# Altium project EL2086.PrjPcb (part 3 of 3)

## Sheet LEFT_CCM.SchDoc: =project_title
size Tabloid; PageSetup: Record=PageOptions|CenterHorizontal=True|CenterVertical=True|PrintScale=0.71|XCorrection=1.00|YCorrection=1.00|PrintKind=0|BorderSize=5000000|LeftOffset=0|BottomOffset=0|Orientation=2|PaperLength=1000|PaperWidth=1000|Scale=100|PaperSource=7|PrintQuality=-4|MediaType=1|DitherType=10|PrintScaleMode=1|PaperKind=A4; CompanyName: Luxonis Holding; DrawnBy: Eason Lin; Organization: Luxonis Holding; Address1: 1925 Harmony Park Drive; Address2: Westminster, CO; Address3: 80234; Address4: United States; DocumentNumber: D2088000; Revision: R0M0E0; SheetNumber: 10; SheetTotal: 14
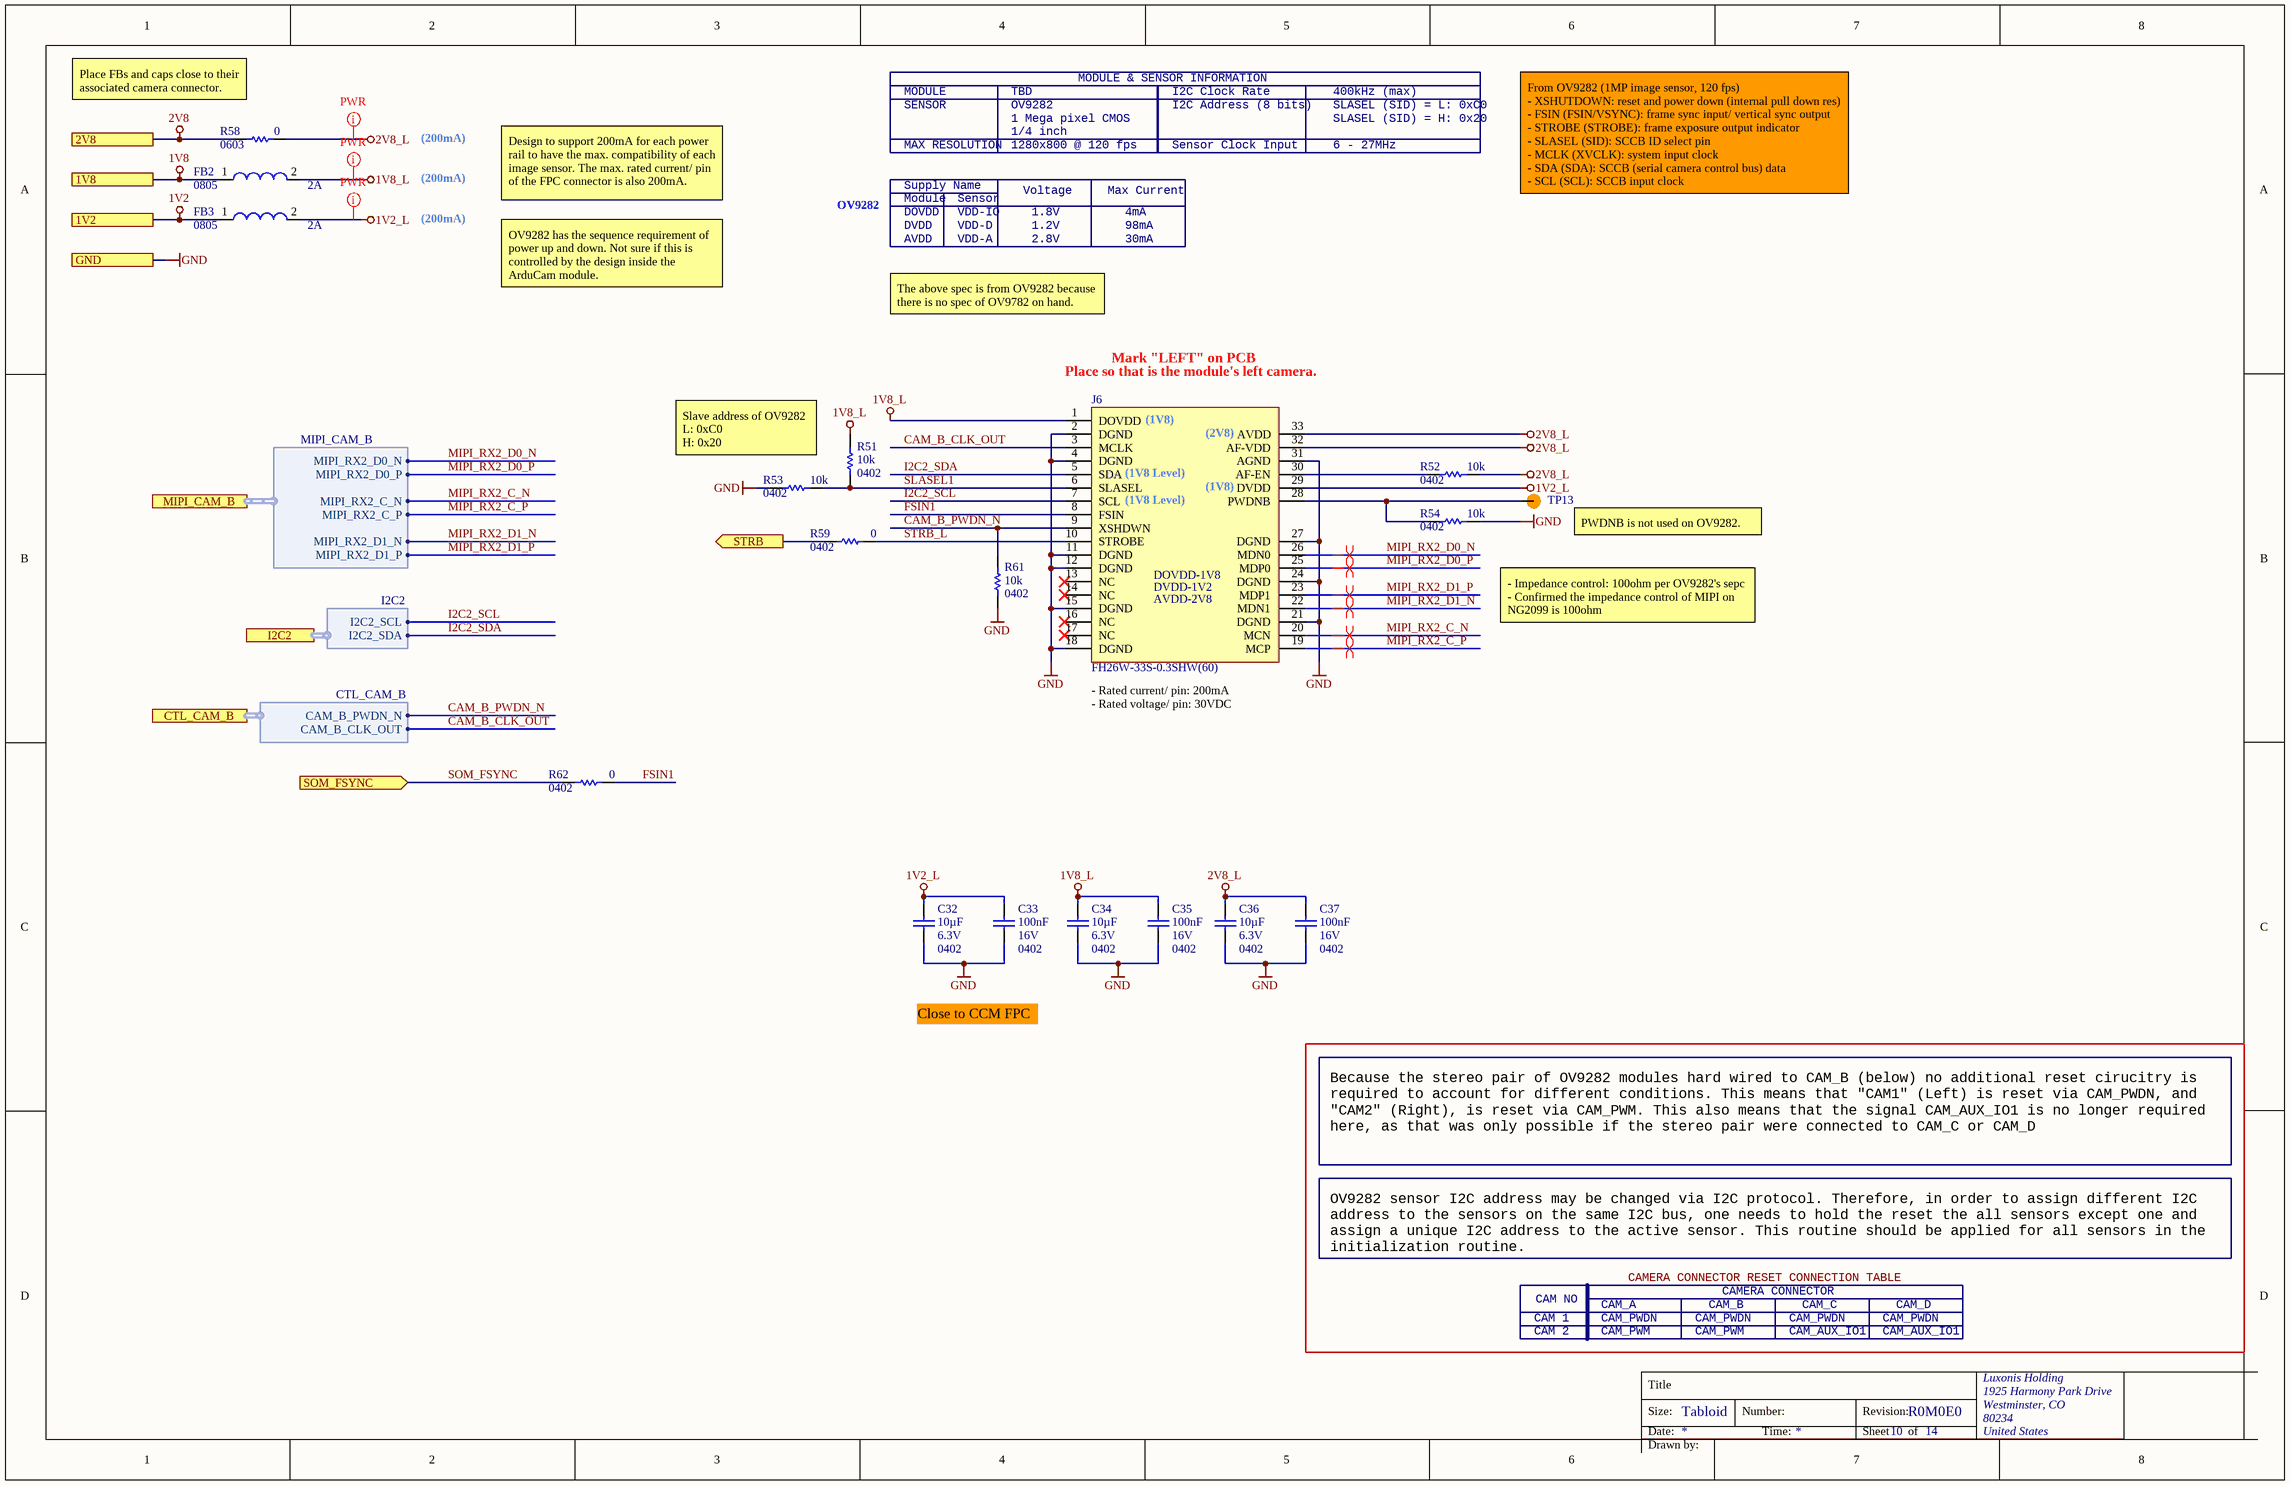
[diagram p9: LEFT_CCM.SchDoc]

### Parts
C32  value 10µF  Voltage Rating: 6.3V  Case/Package: 0402  [CAPC0402(1005)70_N]  (hidden comment: GRM155R60J106ME15D)
C33  value 100nF  Voltage Rating: 16V  Case/Package: 0402  [CAPC0402(1005)60_N]  (hidden comment: CL05B104KO5NFNC)
C34  value 10µF  Voltage Rating: 6.3V  Case/Package: 0402  [CAPC0402(1005)70_N]  (hidden comment: GRM155R60J106ME15D)
C35  value 100nF  Voltage Rating: 16V  Case/Package: 0402  [CAPC0402(1005)60_N]  (hidden comment: CL05B104KO5NFNC)
C36  value 10µF  Voltage Rating: 6.3V  Case/Package: 0402  [CAPC0402(1005)70_N]  (hidden comment: GRM155R60J106ME15D)
C37  value 100nF  Voltage Rating: 16V  Case/Package: 0402  [CAPC0402(1005)60_N]  (hidden comment: CL05B104KO5NFNC)
FB2  Current Rating: 2A  Case/Package: 0805  [2508056017Y2]  (hidden comment: 2508056017Y2)
FB3  Current Rating: 2A  Case/Package: 0805  [2508056017Y2]  (hidden comment: 2508056017Y2)
J6  FH26W-33S-0.3SHW(60)  [AC-PY003-OV9282]
R51  value 10k  Case/Package: 0402  [RESC0402(1005)_N]  (hidden comment: RC0402FR-1310KL)
R52  value 10k  Case/Package: 0402  [RESC0402(1005)_N]  (hidden comment: RC0402FR-1310KL)
R53  value 10k  Case/Package: 0402  [RESC0402(1005)_N]  (hidden comment: RC0402FR-1310KL)
R54  value 10k  Case/Package: 0402  [RESC0402(1005)_N]  (hidden comment: RC0402FR-1310KL)
R58  value 0  Case/Package: 0603  [RESC0603(1608)_N]  (hidden comment: CRCW06030000Z0EA)
R59  value 0  Case/Package: 0402  [RESC0402(1005)_L]  (hidden comment: CRCW04020000Z0ED)
R61  value 10k  Case/Package: 0402  [RESC0402(1005)_N]  (hidden comment: RC0402FR-1310KL)
R62  value 0  Case/Package: 0402  [RESC0402(1005)_L]  (hidden comment: CRCW04020000Z0ED)
TP13  TP075_150_NS  [TP075_150_NS]  (value not drawn)  (no BOM)

### Ports
1V2, 1V8, 2V8, CTL_CAM_B (harness CTL_CAM_B), GND, I2C2 (harness I2C2), MIPI_CAM_B (harness MIPI_CAM_B), SOM_FSYNC (in), STRB (out)

### Harnesses
MIPI_CAM_B: MIPI_RX2_D1_P, MIPI_RX2_D1_N, MIPI_RX2_D0_N, MIPI_RX2_D0_P, MIPI_RX2_C_N, MIPI_RX2_C_P
I2C2: I2C2_SDA, I2C2_SCL
CTL_CAM_B: CAM_B_PWDN_N, CAM_B_CLK_OUT

### Nets
1V2: FB3.1 ; port 1V2
1V2_L: C32.2 C33.2 FB3.2 J6.29(DVDD)
1V8: FB2.1 ; port 1V8
1V8_L: C34.2 C35.2 FB2.2 J6.1(DOVDD) R51.2
2V8: R58.1 ; port 2V8
2V8_L: C36.2 C37.2 J6.32(AF-VDD) J6.33(AVDD) R52.2 R58.2
GND: C32.1 C33.1 C34.1 C35.1 C36.1 C37.1 J6.2(DGND) J6.4(DGND) J6.11(DGND) J6.12(DGND) J6.15(DGND) J6.18(DGND) J6.21(DGND) J6.24(DGND) J6.27(DGND) J6.31(AGND) R53.1 R54.2 R61.1 ; port GND
CAM_B_CLK_OUT: J6.3(MCLK) ; port CTL_CAM_B.CAM_B_CLK_OUT
CAM_B_PWDN_N: J6.9(XSHDWN) R61.2 ; port CTL_CAM_B.CAM_B_PWDN_N
FSIN1: J6.8(FSIN) R62.1
I2C2_SCL: J6.7(SCL) ; port I2C2.I2C2_SCL
I2C2_SDA: J6.5(SDA) ; port I2C2.I2C2_SDA
MIPI_RX2_C_N: J6.20(MCN) ; port MIPI_CAM_B.MIPI_RX2_C_N
MIPI_RX2_C_P: J6.19(MCP) ; port MIPI_CAM_B.MIPI_RX2_C_P
MIPI_RX2_D0_N: J6.26(MDN0) ; port MIPI_CAM_B.MIPI_RX2_D0_N
MIPI_RX2_D0_P: J6.25(MDP0) ; port MIPI_CAM_B.MIPI_RX2_D0_P
MIPI_RX2_D1_N: J6.22(MDN1) ; port MIPI_CAM_B.MIPI_RX2_D1_N
MIPI_RX2_D1_P: J6.23(MDP1) ; port MIPI_CAM_B.MIPI_RX2_D1_P
SLASEL1: J6.6(SLASEL) R51.1 R53.2
SOM_FSYNC: R62.2 ; port SOM_FSYNC
STRB: R59.2 ; port STRB
STRB_L: J6.10(STROBE) R59.1
NetJ6_28: J6.28(PWDNB) R54.1 TP13.1
NetJ6_30: J6.30(AF-EN) R52.1

Not connected (* = marked no-connect by the designer): J6 13(NC)* 14(NC)* 16(NC)* 17(NC)*

### Layout directives
differential pair; net class MIPI; differential pair class 100ohm: MIPI_RX2_C_N, MIPI_RX2_C_P, MIPI_RX2_D0_N, MIPI_RX2_D0_P, MIPI_RX2_D1_N, MIPI_RX2_D1_P
net class PWR; Current Rating: 200mA: 1V2_L, 1V8_L, 2V8_L

### Notes on the sheet
- (near R58) Place FBs and caps close to their associated camera connector.
- MODULE
- TBD
- MODULE & SENSOR INFORMATION
- I2C Clock Rate
- 400kHz (max)
- (200mA)
- SENSOR
- MAX RESOLUTION
- 1 Mega pixel CMOS
- 1280x800 @ 120 fps
- OV9282
- 1/4 inch
- I2C Address (8 bits)
- Sensor Clock Input
- SLASEL (SID) = L: 0xC0
- SLASEL (SID) = H: 0x20
- 6 - 27MHz
- Design to support 200mA for each power rail to have the max. compatibility of each image sensor. The max. rated current/ pin of the FPC connector is also 200mA.
- DOVDD
- DVDD
- Supply Name
- Module
- VDD-IO
- VDD-D
- Sensor
- Voltage
- 1.8V
- 1.2V
- Max Current
- 4mA
- 98mA
- From OV9282 (1MP image sensor, 120 fps)
  - XSHUTDOWN: reset and power down (internal pull down res)
  - FSIN (FSIN/VSYNC): frame sync input/ vertical sync output
  - STROBE (STROBE): frame exposure output indicator
  - SLASEL (SID): SCCB ID select pin
  - MCLK (XVCLK): system input clock
  - SDA (SDA): SCCB (serial camera control bus) data
  - SCL (SCL): SCCB input clock
- OV9282 has the sequence requirement of power up and down. Not sure if this is controlled by the design inside the ArduCam module.
- AVDD
- VDD-A
- 2.8V
- 30mA
- The above spec is from OV9282 because there is no spec of OV9782 on hand.
- Mark "LEFT" on PCB
- (near J6) Place so that is the module's left camera.
- (near J6) (1V8)
- (near J6) (2V8)
- Slave address of OV9282
  L: 0xC0
  H: 0x20
- (near J6) (1V8 Level)
- (near TP13) PWDNB is not used on OV9282.
- - Impedance control: 100ohm per OV9282's sepc
  - Confirmed the impedance control of MIPI on NG2099 is 100ohm
- (near J6) - Rated current/ pin: 200mA
  - Rated voltage/ pin: 30VDC
- Close to CCM FPC
- Because the stereo pair of OV9282 modules hard wired to CAM_B (below) no additional reset cirucitry is required to account for different conditions. This means that "CAM1" (Left) is reset via CAM_PWDN, and "CAM2" (Right), is reset via CAM_PWM. This also means that the signal CAM_AUX_IO1 is no longer required here, as that was only possible if the stereo pair were connected to CAM_C or CAM_D
- OV9282 sensor I2C address may be changed via I2C protocol. Therefore, in order to assign different I2C address to the sensors on the same I2C bus, one needs to hold the reset the all sensors except one and assign a unique I2C address to the active sensor. This routine should be applied for all sensors in the initialization routine.
- CAM NO
- CAMERA CONNECTOR RESET CONNECTION TABLE
- CAMERA CONNECTOR
- CAM 1
- CAM 2
- CAM_A
- CAM_PWDN
- CAM_PWM
- CAM_B
- CAM_AUX_IO1
- CAM_C
- CAM_D
- Title
- Size:
- Date:
- Tabloid
- Number:
- Time:
- Revision:
- Sheet
- of
- Drawn by:
- (in symbol AC_PY003-OV9282_CON) DOVDD-1V8; DVDD-1V2; AVDD-2V8

### Library data of the parts
C32 C34 C36 = CMP-004-000009-5: CAP CER 10UF 6.3V X5R 0402 20%; Manufacturer 1: Murata; Dielectric: X5R; Manufacturer Part Number 1: GRM155R60J106ME15D; ComponentLink1URL: https://www.murata.com/~/media/webrenewal/support/library/catalog/products/capacitor/mlcc/c02e.ashx?la=en-us&src-supplier=Digi-Key; Design Item ID: GRM155R60J106ME15D; Tolerance: 20%; Width: 0.02inch; Length: 0.039inch; Mounting Technology: SMT; Min Operating Temperature: -55°C; Max Operating Temperature: 85°C; ComponentLink1Description: https://www.murata.com/~/media/webrenewal/support/library/catalog/products/capacitor/mlcc/c02e.ashx?la=en-us&src-supplier=Digi-Key
C33 C35 C37 = CMP-108-000002-6: CAP CER 0.1UF 16V X7R 0402 10%; Manufacturer 1: Samsung; ComponentLink1URL: https://datasheet.ciiva.com/25767/cl05b104ko5nfnc-25767124.pdf?src-supplier=Digi-Key; Length: 1mm; Design Item ID: CL05B104KO5NFNC; Tolerance: 10%; Min Operating Temperature: -55°C; Width: 0.02inch; Dielectric: X7R; ComponentLink1Description: https://datasheet.ciiva.com/25767/cl05b104ko5nfnc-25767124.pdf?src-supplier=Digi-Key; Height: 0.5mm; Depth: 0.5mm; Manufacturer Part Number 1: CL05B104KO5NFNC; Max Operating Temperature: 125°C; Mounting Technology: SMT
FB2 FB3 = CMP-082-000000-2: FERRITE BEAD, 0.1OHM, 2A, 0805, 600R/100MHz; Manufacturer 1: Fair-Rite; Tolerance: 25%; Manufacturer Part Number 1: 2508056017Y2
J6 = AC_PY003-OV9282_CON: FFC/FPC Connector, 33 Contact(s), 1 Row(s), Female, Right Angle, Surface Mount Terminal; Manufacturer 1: Hirose; Supplier 1: Digi-Key; Manufacturer Part Number 1: FH26W-33S-0.3SHW(60); RoHS: Yes; Category: FFC / FPC; Stock 1: 627; Pricing 1: 1=1,78000, 10=1,61700, 25=1,51800, 50=1,45200, 100=1,38600, 250=1,25400, 500=1,15500, 1000=0,99000, 2500=0,92400 (USD); ComponentLink1URL: https://datasheet.ciiva.com:443/pdfs/VipMasterIC/IC/HIRO/HIRO-S-A0007913874/HIRO-S-A0008593114-1.pdf?src-supplier=IHS+Markit; ComponentLink1Description: https://datasheet.ciiva.com:443/pdfs/VipMasterIC/IC/HIRO/HIRO-S-A0007913874/HIRO-S-A0008593114-1.pdf?src-supplier=IHS+Markit; ComponentLink2URL: https://www.hirose.com/product/en/download_file/key_name/FH26/category/Catalog/doc_file_id/49355/?file_category_id=4&item_id=298&is_series=1&src-supplier=Digi-Key; ComponentLink2Description: https://www.hirose.com/product/en/download_file/key_name/FH26/category/Catalog/doc_file_id/49355/?file_category_id=4&item_id=298&is_series=1&src-supplier=Digi-Key; ComponentLink3URL: https://www.hirose.com/product/download/?distributor=digikey&amp;type=2d&amp;lang=en&amp;num=FH26W-13S-0.3SHW(60)&src-supplier=Digi-Key; ComponentLink3Description: https://www.hirose.com/product/download/?distributor=digikey&amp;type=2d&amp;lang=en&amp;num=FH26W-13S-0.3SHW(60)&src-supplier=Digi-Key; Supplier Part Number 1: H125800CT-ND
R51-R54 R61 = CMP-115-000004-8: as R93-R95 on sheet TOF_VGA; Min Operating Temperature: -55°C; Max Operating Temperature: 155°C; Design Item ID: RC0402FR-1310KL; Tolerance: 1%; Manufacturer Part Number 1: RC0402FR-1310KL
R58 = CMP-115-000011-7: RES SMD 0 OHM 5% 1/10W 0603; Manufacturer 1: Vishay; Manufacturer Part Number 1: CRCW0603-0000Z0EA; Temperature Coefficient: 100ppm/°C; Power Rating: 100mW; Voltage Rating: 75V; Tolerance: 5%; Design Item ID: CRCW06030000Z0EA; Max Operating Temperature: 155°C; Min Operating Temperature: -55°C
R59 R62 = CMP-013-000022-11: RES SMD 0 OHM 5% 1/16W 0402; Manufacturer 1: Vishay; Voltage Rating: 50V; Power Rating: 63mW; Max Operating Temperature: 155°C; Manufacturer Part Number 1: CRCW04020000Z0ED; Tolerance: 5%; Min Operating Temperature: -55°C; Design Item ID: CRCW04020000Z0ED
TP13 = TEST_POINT

## Sheet IMU.SchDoc: =project_title
size Tabloid; CompanyName: Luxonis Holding; DrawnBy: Eason Lin; Organization: Luxonis Holding; Address1: 1925 Harmony Park Drive; Address2: Westminster, CO; Address3: 80234; Address4: United States; DocumentNumber: D2088000; Revision: R0M0E0; SheetNumber: 9; SheetTotal: 14
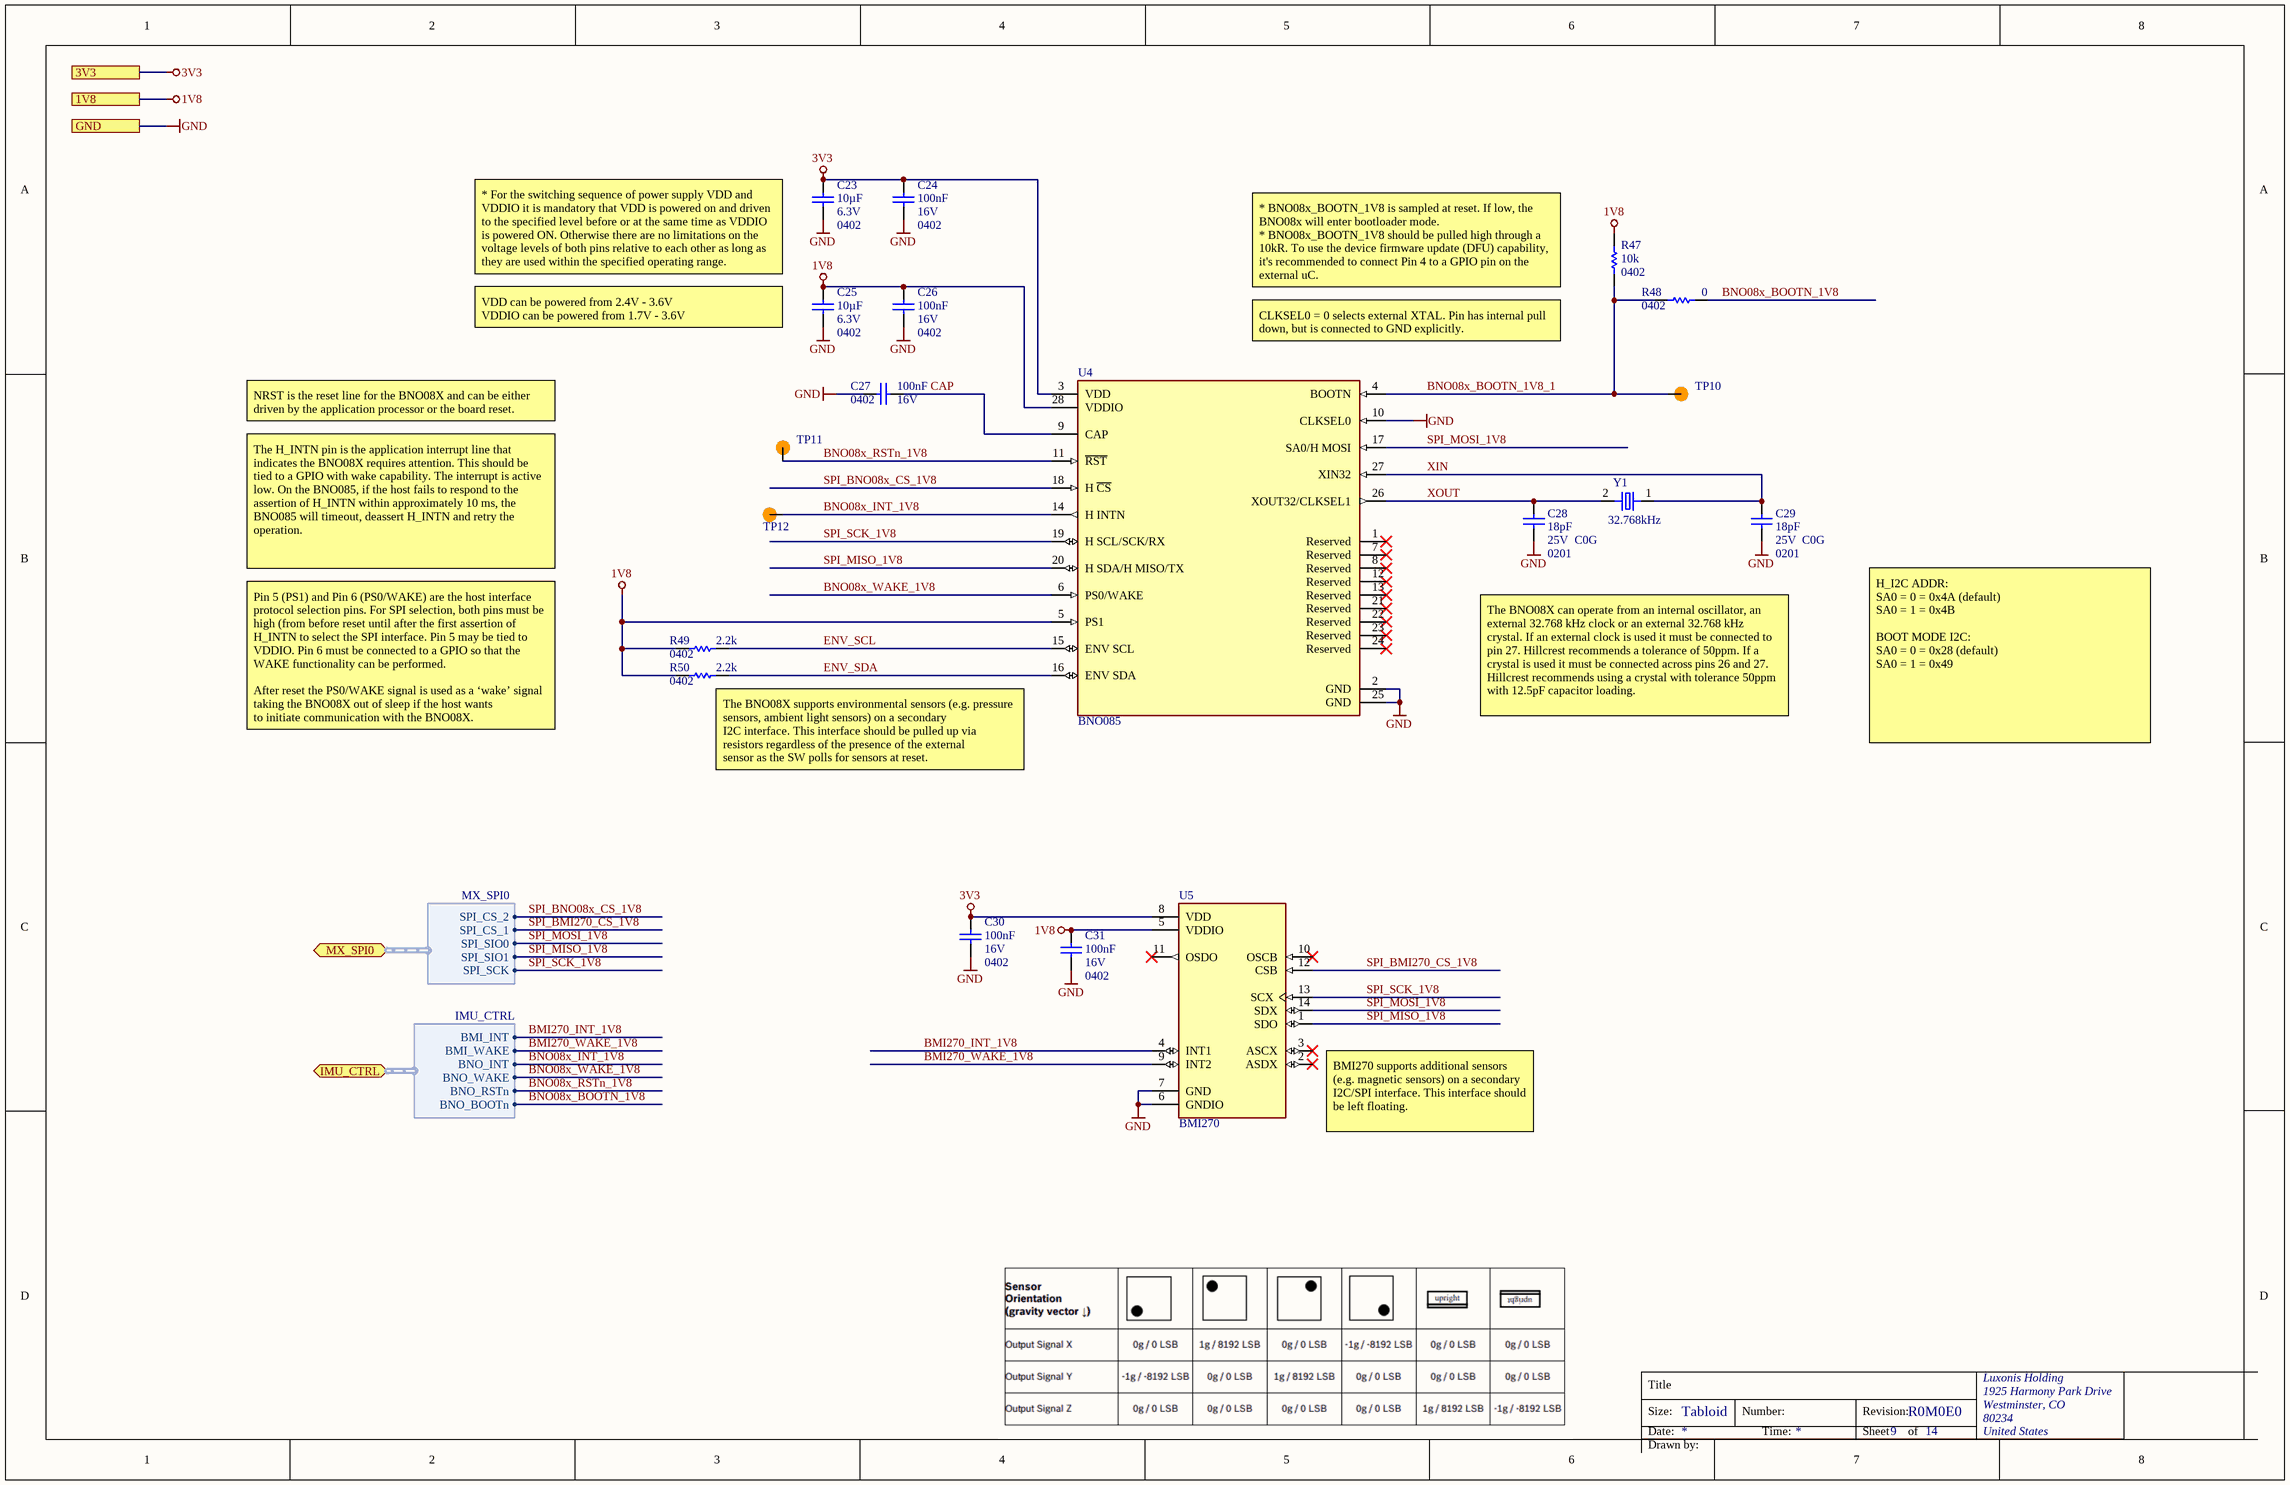
[diagram p10: IMU.SchDoc]

### Parts
C23  value 10µF  Voltage Rating: 6.3V  Case/Package: 0402  [CAPC0402(1005)70_N]  (hidden comment: GRM155R60J106ME15D)
C24  value 100nF  Voltage Rating: 16V  Case/Package: 0402  [CAPC0402(1005)60_N]  (hidden comment: CL05B104KO5NFNC)
C25  value 10µF  Voltage Rating: 6.3V  Case/Package: 0402  [CAPC0402(1005)70_N]  (hidden comment: GRM155R60J106ME15D)
C26  value 100nF  Voltage Rating: 16V  Case/Package: 0402  [CAPC0402(1005)60_N]  (hidden comment: CL05B104KO5NFNC)
C27  value 100nF  Voltage Rating: 16V  Case/Package: 0402  [CAPC0402(1005)60_N]  (hidden comment: CL05B104KO5NFNC)
C28  value 18pF  Case/Package: 0201  Voltage Rating: 25V  Dielectric: C0G  [CAPC0201(0603)33_L]  (hidden comment: GRM0335C1E180FA01D)
C29  value 18pF  Case/Package: 0201  Voltage Rating: 25V  Dielectric: C0G  [CAPC0201(0603)33_L]  (hidden comment: GRM0335C1E180FA01D)
C30  value 100nF  Voltage Rating: 16V  Case/Package: 0402  [CAPC0402(1005)60_N]  (hidden comment: CL05B104KO5NFNC)
C31  value 100nF  Voltage Rating: 16V  Case/Package: 0402  [CAPC0402(1005)60_N]  (hidden comment: CL05B104KO5NFNC)
R47  value 10k  Case/Package: 0402  [RESC0402(1005)_N]  (hidden comment: RC0402FR-1310KL)
R48  value 0  Case/Package: 0402  [RESC0402(1005)_L]  (hidden comment: CRCW04020000Z0ED)
R49  value 2.2k  Case/Package: 0402  [RESC0402(1005)_L]  (hidden comment: RC0402FR-072K2L)
R50  value 2.2k  Case/Package: 0402  [RESC0402(1005)_L]  (hidden comment: RC0402FR-072K2L)
TP10  TEST_POINT  [TP075_150_NS]  (value not drawn)  (no BOM)
TP11  TEST_POINT  [TP075_150_NS]  (value not drawn)  (no BOM)
TP12  TEST_POINT  [TP075_150_NS]  (value not drawn)  (no BOM)
U4  BNO085  [BNO085]
U5  BMI270  [XDCR_BMI270]
Y1  Frequency: 32.768kHz  [ABS06-127-32.768KHZ-T]  (hidden comment: ABS06-127-32.768KHZ-T)

### Ports
1V8, 3V3, GND, IMU_CTRL (bidir, harness IMU_CTRL), MX_SPI0 (bidir, harness MX_SPI0)

### Harnesses
MX_SPI0: SPI_SIO0, SPI_SIO1, SPI_CS_1, SPI_SCK, SPI_CS_2
IMU_CTRL: BMI_INT, BMI_WAKE, BNO_INT, BNO_WAKE, BNO_RSTn, BNO_BOOTn

### Nets
1V8: C25.2 C26.2 C31.2 R47.2 R49.1 R50.1 U4.5(PS1) U4.28(VDDIO) U5.5(VDDIO) ; port 1V8
3V3: C23.2 C24.2 C30.2 U4.3(VDD) U5.8(VDD) ; port 3V3
GND: C23.1 C24.1 C25.1 C26.1 C27.2 C28.1 C29.1 C30.1 C31.1 U4.2(GND) U4.10(CLKSEL0) U4.25(GND) U5.6(GNDIO) U5.7(GND) ; port GND
BMI270_INT_1V8: U5.4(INT1) ; port IMU_CTRL.BMI_INT
BMI270_WAKE_1V8: U5.9(INT2) ; port IMU_CTRL.BMI_WAKE
BNO08x_BOOTN_1V8: R48.2 ; port IMU_CTRL.BNO_BOOTn
BNO08x_BOOTN_1V8_1: R47.1 R48.1 TP10.1 U4.4(BOOTN)
BNO08x_INT_1V8: TP12.1 U4.14(H_INTN) ; port IMU_CTRL.BNO_INT
BNO08x_RSTn_1V8: TP11.1 U4.11(~{RST}) ; port IMU_CTRL.BNO_RSTn
BNO08x_WAKE_1V8: U4.6(PS0/WAKE) ; port IMU_CTRL.BNO_WAKE
CAP: C27.1 U4.9(CAP)
ENV_SCL: R49.2 U4.15(ENV_SCL)
ENV_SDA: R50.2 U4.16(ENV_SDA)
SPI_BMI270_CS_1V8: U5.12(CSB) ; port MX_SPI0.SPI_CS_1
SPI_BNO08x_CS_1V8: U4.18(H_~{CS}) ; port MX_SPI0.SPI_CS_2  [project net SPI_BNO085_CS_1V8]
SPI_MISO_1V8: U4.20(H_SDA/H_MISO/TX) U5.1(SDO) ; port MX_SPI0.SPI_SIO1
SPI_MOSI_1V8: U4.17(SA0/H_MOSI) U5.14(SDX) ; port MX_SPI0.SPI_SIO0
SPI_SCK_1V8: U4.19(H_SCL/SCK/RX) U5.13(SCX) ; port MX_SPI0.SPI_SCK
XIN: C29.2 U4.27(XIN32) Y1.1
XOUT: C28.2 U4.26(XOUT32/CLKSEL1) Y1.2

Not connected (* = marked no-connect by the designer): U4 1(Reserved)* 7(Reserved)* 8(Reserved)* 12(Reserved)* 13(Reserved)* 21(Reserved)* 22(Reserved)* 23(Reserved)* 24(Reserved)*; U5 2(ASDX)* 3(ASCX)* 10(OSCB)* 11(OSDO)*

### Notes on the sheet
- * For the switching sequence of power supply VDD and VDDIO it is mandatory that VDD is powered on and driven to the specified level before or at the same time as VDDIO is powered ON. Otherwise there are no limitations on the voltage levels of both pins relative to each other as long as they are used within the specified operating range.
- * BNO08x_BOOTN_1V8 is sampled at reset. If low, the BNO08x will enter bootloader mode.
  * BNO08x_BOOTN_1V8 should be pulled high through a 10kR. To use the device firmware update (DFU) capability, it's recommended to connect Pin 4 to a GPIO pin on the external uC.
- (near C25) VDD can be powered from 2.4V - 3.6V
  VDDIO can be powered from 1.7V - 3.6V
- CLKSEL0 = 0 selects external XTAL. Pin has internal pull down, but is connected to GND explicitly.
- NRST is the reset line for the BNO08X and can be either driven by the application processor or the board reset.
- The H_INTN pin is the application interrupt line that indicates the BNO08X requires attention. This should be tied to a GPIO with wake capability. The interrupt is active low. On the BNO085, if the host fails to respond to the assertion of H_INTN within approximately 10 ms, the BNO085 will timeout, deassert H_INTN and retry the operation.
- Pin 5 (PS1) and Pin 6 (PS0/WAKE) are the host interface protocol selection pins. For SPI selection, both pins must be high (from before reset until after the first assertion of H_INTN to select the SPI interface. Pin 5 may be tied to VDDIO. Pin 6 must be connected to a GPIO so that the WAKE functionality can be performed.
  After reset the PS0/WAKE signal is used as a ‘wake’ signal taking the BNO08X out of sleep if the host wants
  to initiate communication with the BNO08X.
- (near R50) The BNO08X supports environmental sensors (e.g. pressure sensors, ambient light sensors) on a secondary
  I2C interface. This interface should be pulled up via resistors regardless of the presence of the external
  sensor as the SW polls for sensors at reset.
- The BNO08X can operate from an internal oscillator, an external 32.768 kHz clock or an external 32.768 kHz crystal. If an external clock is used it must be connected to pin 27. Hillcrest recommends a tolerance of 50ppm. If a crystal is used it must be connected across pins 26 and 27. Hillcrest recommends using a crystal with tolerance 50ppm with 12.5pF capacitor loading.
- H_I2C ADDR:
  SA0 = 0 = 0x4A (default)
  SA0 = 1 = 0x4B
  BOOT MODE I2C:
  SA0 = 0 = 0x28 (default)
  SA0 = 1 = 0x49
- (near U5) BMI270 supports additional sensors (e.g. magnetic sensors) on a secondary I2C/SPI interface. This interface should be left floating.
- Title
- Size:
- Date:
- Tabloid
- Number:
- Time:
- Revision:
- Sheet
- of
- Drawn by:

### Library data of the parts
C23 C25 = CMP-004-000009-5: as C32 on sheet LEFT_CCM; Dielectric: X5R; Manufacturer Part Number 1: GRM155R60J106ME15D; ComponentLink1URL: https://www.murata.com/~/media/webrenewal/support/library/catalog/products/capacitor/mlcc/c02e.ashx?la=en-us&src-supplier=Digi-Key; Design Item ID: GRM155R60J106ME15D; Tolerance: 20%; Width: 0.02inch; Length: 0.039inch; Mounting Technology: SMT; Min Operating Temperature: -55°C; Max Operating Temperature: 85°C; ComponentLink1Description: https://www.murata.com/~/media/webrenewal/support/library/catalog/products/capacitor/mlcc/c02e.ashx?la=en-us&src-supplier=Digi-Key
C24 C26 C27 C30 C31 = CMP-108-000002-6: as C33 on sheet LEFT_CCM; ComponentLink1URL: https://datasheet.ciiva.com/25767/cl05b104ko5nfnc-25767124.pdf?src-supplier=Digi-Key; Length: 1mm; Design Item ID: CL05B104KO5NFNC; Tolerance: 10%; Min Operating Temperature: -55°C; Width: 0.02inch; Dielectric: X7R; ComponentLink1Description: https://datasheet.ciiva.com/25767/cl05b104ko5nfnc-25767124.pdf?src-supplier=Digi-Key; Height: 0.5mm; Depth: 0.5mm; Manufacturer Part Number 1: CL05B104KO5NFNC; Max Operating Temperature: 125°C; Mounting Technology: SMT
C28 C29 = CMP-004-000003-6: CAP CER 18PF 25V C0G 0201 10%; Manufacturer 1: Murata; Tolerance: 1%; Manufacturer Part Number 1: GRM0335C1E180FA01D; Min Operating Temperature: -55°C; Max Operating Temperature: 125°C; Length: 0.024inch; Height: 0.3mm; Width: 0.3mm; ComponentLink1URL: https://datasheet.ciiva.com/29538/partnumbering-e-01-29538328.pdf?src-supplier=Digi-Key; ComponentLink1Description: https://datasheet.ciiva.com/29538/partnumbering-e-01-29538328.pdf?src-supplier=Digi-Key; Design Item ID: GRM0335C1E180FA01D; Mounting Technology: SMT
R47 = CMP-115-000004-8: RES SMD 10K OHM 1% 1/16W 0402; Manufacturer 1: Yageo; Temperature Coefficient: 100ppm/°C; Power Rating: 62.5mW; Voltage Rating: 50V; Manufacturer Part Number 1: RC0402FR-1310KL; Min Operating Temperature: -55°C; Max Operating Temperature: 155°C; Tolerance: 1%; Design Item ID: RC0402FR-1310KL
R48 = CMP-013-000022-11: as R59 on sheet LEFT_CCM; Max Operating Temperature: 155°C; Manufacturer Part Number 1: CRCW04020000Z0ED; Tolerance: 5%; Min Operating Temperature: -55°C; Design Item ID: CRCW04020000Z0ED
R49 R50 = CMP-013-000013-8: RES SMD 2.2K OHM 1% 1/16W 0402; Manufacturer 1: Yageo; Power Rating: 63mW; Voltage Rating: 50V; Manufacturer Part Number 1: RC0402FR-072K2L; Min Operating Temperature: -55°C; Max Operating Temperature: 155°C; Tolerance: 1%; Design Item ID: RC0402FR-072K2L
TP10-TP12 = CMP-015-000000-2: Manufacturer Part Number 1: /; Design Item ID: TEST_POINT; Source: LuxonisMaster.SchLib
U4 = CMP-016-000000-2: IMU ACCEL/GYRO/MAG I2C 32BIT; Manufacturer 1: Hillcrest Laboratories; Sensor Type: Accelerometer,Gyroscope,Magnetometer; Manufacturer Part Number 1: BNO085; Case/Package: LGA
U5 = BMI270: Accelerometer, Gyroscope, 6 Axis Sensor IÂ²C, SPI Output; Manufacturer 1: Bosch Sensortec; Price: None; SnapEDA_Link: https://www.snapeda.com/parts/BMI270/Bosch%20Sensortec/view-part/3595167/?ref=snap; Manufacturer Part Number 1: BMI270; Availability: Unavailable; Value: *; Package: LGA-14 Bosch Sensortec
Y1 = CMP-006-000001-2: CRYSTAL 32.768kHz ±20ppm Crystal 12.5pF 90 kOhms 2-SMD, No Lead; Manufacturer 1: Abracon; Manufacturer Part Number 1: ABS06-127-32.768KHZ-T; Case/Package: SMD/SMT; Min Operating Temperature: -40°C; Max Operating Temperature: 85°C; Tolerance: 20ppm

## Sheet EEPROM.SchDoc: =project_title
size Tabloid; PageSetup: Record=PageOptions|CenterHorizontal=True|CenterVertical=True|PrintScale=0.73|XCorrection=1.00|YCorrection=1.00|PrintKind=0|BorderSize=5000000|LeftOffset=0|BottomOffset=0|Orientation=2|PaperLength=1000|PaperWidth=1000|Scale=100|PaperSource=7|PrintQuality=-4|MediaType=1|DitherType=10|PaperKind=A4|PrintScaleMode=1; CompanyName: Luxonis Holding; DrawnBy: Eason Lin; Organization: Luxonis Holding; Address1: 1925 Harmony Park Drive; Address2: Westminster, CO; Address3: 80234; Address4: United States; DocumentNumber: D2088000; Revision: R0M0E0; SheetNumber: 8; SheetTotal: 14
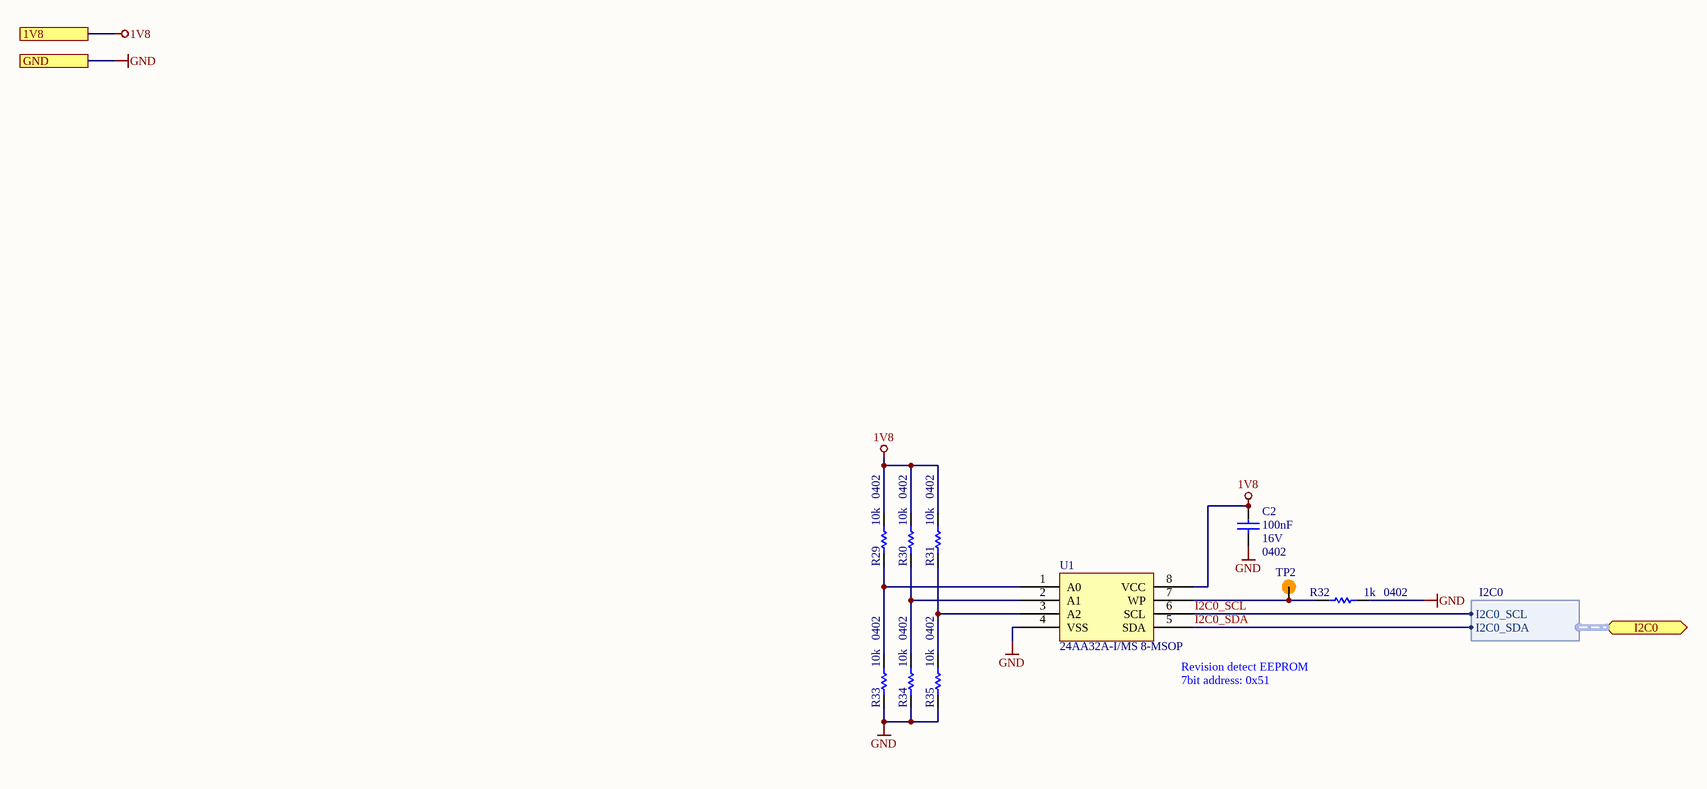
[diagram p11: EEPROM.SchDoc]

### Parts
C2  value 100nF  Voltage Rating: 16V  Case/Package: 0402  [CAPC0402(1005)60_N]  (hidden comment: CL05B104KO5NFNC)
R29  value 10k  Case/Package: 0402  [RESC0402(1005)_N]  (hidden comment: RC0402FR-1310KL)
R30  value 10k  Case/Package: 0402  [RESC0402(1005)_N]  (hidden comment: RC0402FR-1310KL)
R31  value 10k  Case/Package: 0402  [RESC0402(1005)_N]  (hidden comment: RC0402FR-1310KL)
R32  value 1k  Case/Package: 0402  [RESC0402(1005)_L]  (hidden comment: RC0402FR-071KL)
R33  value 10k  Case/Package: 0402  [RESC0402(1005)_N]  (hidden comment: RC0402FR-1310KL)
R34  value 10k  Case/Package: 0402  [RESC0402(1005)_N]  (hidden comment: RC0402FR-1310KL)
R35  value 10k  Case/Package: 0402  [RESC0402(1005)_N]  (hidden comment: RC0402FR-1310KL)
TP2  TP075_150_NS  [TP075_150_NS]  (value not drawn)  (no BOM)
U1  24AA32A-I/MS 8-MSOP  [24AA32A-I/MS]

### Ports
1V8, GND, I2C0 (bidir, harness I2C0)

### Harnesses
I2C0: I2C0_SCL, I2C0_SDA

### Nets
1V8: C2.2 R29.2 R30.2 R31.2 U1.8(VCC) ; port 1V8
GND: C2.1 R32.1 R33.1 R34.1 R35.1 U1.4(VSS) ; port GND
I2C0_SCL: U1.6(SCL) ; port I2C0.I2C0_SCL
I2C0_SDA: U1.5(SDA) ; port I2C0.I2C0_SDA
NetR29_1: R29.1 R33.2 U1.1(A0)
NetR30_1: R30.1 R34.2 U1.2(A1)
NetR31_1: R31.1 R35.2 U1.3(A2)
NetR32_2: R32.2 TP2.1 U1.7(WP)

### Notes on the sheet
- (near U1) Revision detect EEPROM
- (near U1) 7bit address: 0x51
- Title
- Size:
- Date:
- Tabloid
- Number:
- Time:
- Revision:
- Sheet
- of
- Drawn by:

### Library data of the parts
C2 = CMP-108-000002-6: as C33 on sheet LEFT_CCM; ComponentLink1URL: https://datasheet.ciiva.com/25767/cl05b104ko5nfnc-25767124.pdf?src-supplier=Digi-Key; Length: 1mm; Design Item ID: CL05B104KO5NFNC; Tolerance: 10%; Min Operating Temperature: -55°C; Width: 0.02inch; Dielectric: X7R; ComponentLink1Description: https://datasheet.ciiva.com/25767/cl05b104ko5nfnc-25767124.pdf?src-supplier=Digi-Key; Height: 0.5mm; Depth: 0.5mm; Manufacturer Part Number 1: CL05B104KO5NFNC; Max Operating Temperature: 125°C; Mounting Technology: SMT
R29-R31 R33-R35 = CMP-115-000004-8: as R93-R95 on sheet TOF_VGA; Min Operating Temperature: -55°C; Max Operating Temperature: 155°C; Design Item ID: RC0402FR-1310KL; Tolerance: 1%; Manufacturer Part Number 1: RC0402FR-1310KL
R32 = CMP-013-000004-10: RES SMD 1K OHM 1% 1/16W 0402; Manufacturer 1: Yageo; Power Rating: 62.5mW; Voltage Rating: 50V; Min Operating Temperature: -55°C; Design Item ID: RC0402FR-071KL; Tolerance: 1%; Max Operating Temperature: 155°C; Manufacturer Part Number 1: RC0402FR-071KL
TP2 = TEST_POINT
U1 = 24AA32A-I/MS: IC EEPROM 32K I2C 400KHZ 8MSOP Memory IC 32Kb (4K x 8) I²C 400kHz 900ns 8-MSOP; Manufacturer 1: Microchip; Interface: I2C,Serial,2-Wire; Access Time: 3500ns; Max Supply Voltage: 5.5V; Min Supply Voltage: 1.7V; Nominal Supply Current: 3mA; Supplier 1: Digi-Key; Stock 1: 4213; Pricing 1: 1=0.39000, 25=0.38120, 100=0.36050 (USD); RoHS: Yes; Mount: Surface Mount; Case/Package: MSOP; Number of Pins: 8; Contact Plating: Tin,Matte; Min Operating Temperature: -40°C; Max Operating Temperature: 85°C; Max Frequency: 400kHz; Frequency: 400kHz; Packaging: Rail/Tube; Density: 32Kb; Memory Size: 32Kb; Package Quantity: 100; Length: 3mm; Height: 0.85mm; Width: 3mm; Radiation Hardening: No; Lead Free: Lead Free; REACH SVHC: No SVHC; ComponentLink1URL: https://datasheet.ciiva.com/16309/filehandler-aspxddocname-en011853-16309808.pdf?src-supplier=Future+Electronics; ComponentLink1Description: https://datasheet.ciiva.com/16309/filehandler-aspxddocname-en011853-16309808.pdf?src-supplier=Future+Electronics; ComponentLink2URL: https://datasheet.ciiva.com/16621/21713l-16621382.pdf?src-supplier=Avnet+Europe; ComponentLink2Description: https://datasheet.ciiva.com/16621/21713l-16621382.pdf?src-supplier=Avnet+Europe; ComponentLink3URL: https://datasheet.ciiva.com/3185/21713l-3185209.pdf?src-supplier=Avnet; ComponentLink3Description: https://datasheet.ciiva.com/3185/21713l-3185209.pdf?src-supplier=Avnet; ComponentLink4URL: https://datasheet.ciiva.com/1154/1688094-1154810.pdf?src-supplier=Element14; ComponentLink4Description: https://datasheet.ciiva.com/1154/1688094-1154810.pdf?src-supplier=Element14; ComponentLink5URL: https://datasheet.ciiva.com/41454/001085239-da-01-en-ic-eeprom-32kbit-24aa32a-i-ms-msop-8-mcp-41454934.pdf?src-supplier=Conrad; ComponentLink5Description: https://datasheet.ciiva.com/41454/001085239-da-01-en-ic-eeprom-32kbit-24aa32a-i-ms-msop-8-mcp-41454934.pdf?src-supplier=Conrad; Supplier Part Number 1: 24AA32A-I/MS-ND; Memory Type: EEPROM; Manufacturer Part Number 1: 24AA32A-I/MS; Supplier 2: Mouser; Supplier 3: Newark; Supplier Part Number 2: 579-24AA32A-I/MS; Supplier Part Number 3: 38AH9658

## Sheet DOT_LED.SchDoc: =project_title
size Tabloid; CompanyName: Luxonis Holding; DrawnBy: Eason Lin; Organization: Luxonis Holding; Address1: 1925 Harmony Park Drive; Address2: Westminster, CO; Address3: 80234; Address4: United States; DocumentNumber: D2088000; Revision: R0M0E0; SheetNumber: 13; SheetTotal: 13
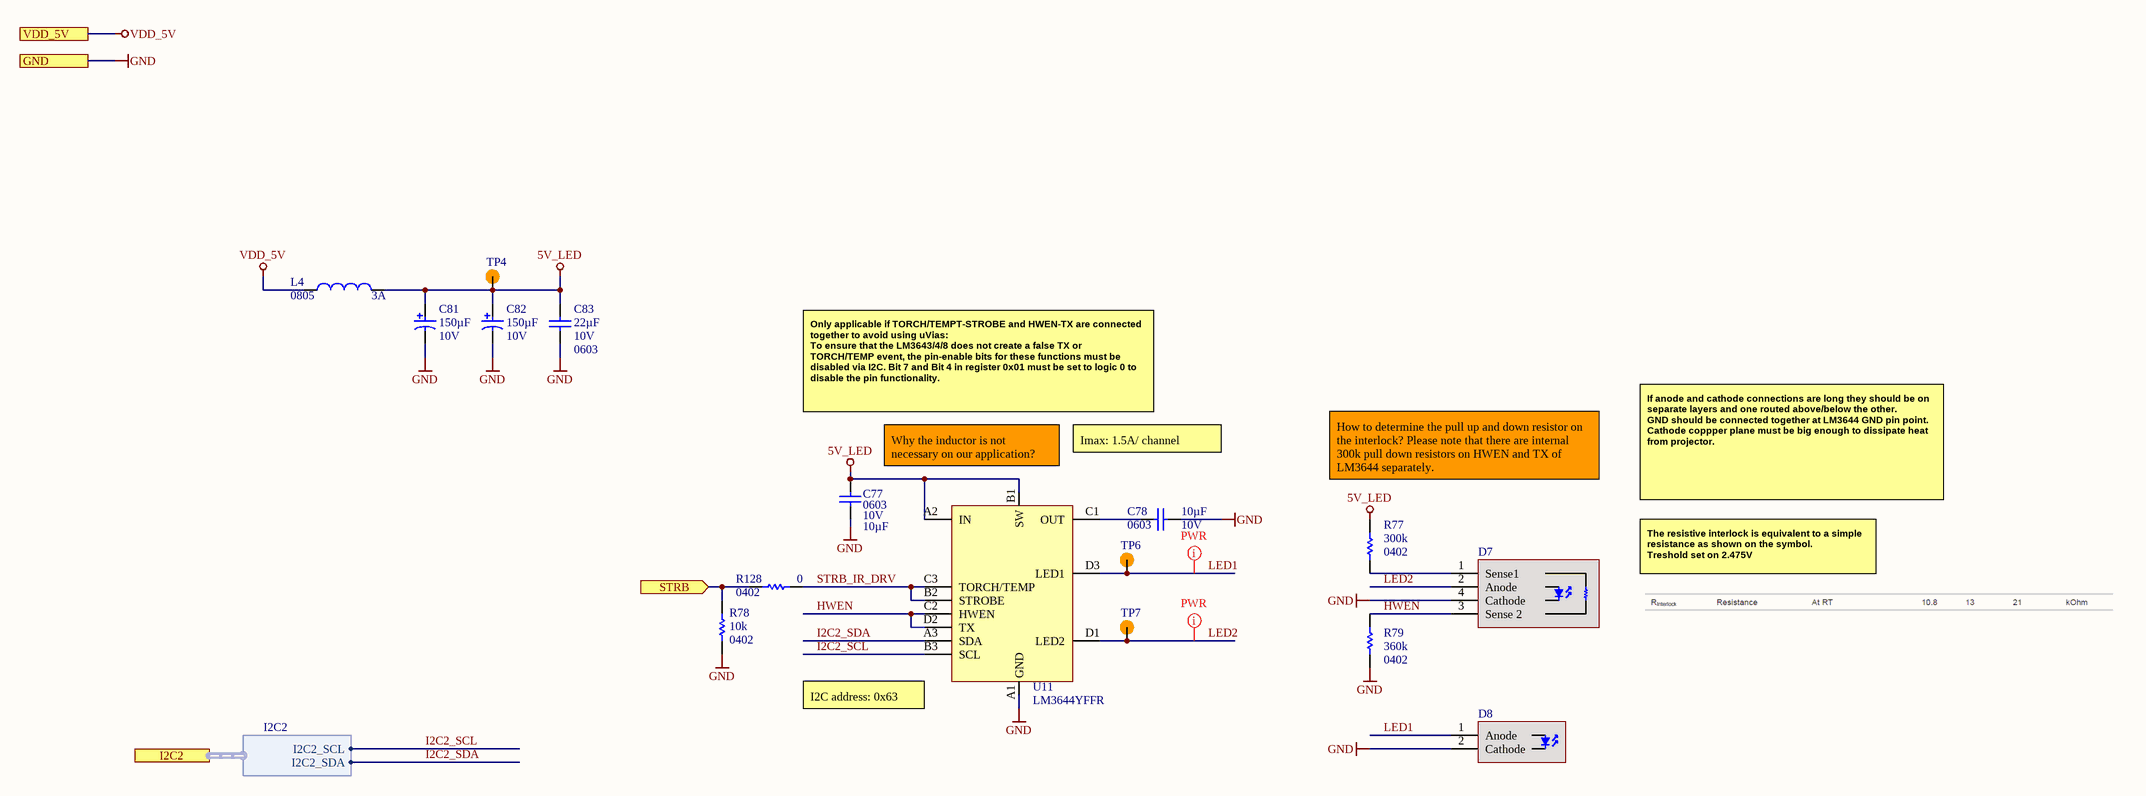
[diagram p12: DOT_LED.SchDoc]

### Parts
C77  value 10µF  Case/Package: 0603  Voltage Rating: 10V  [CAPC0603(1608)100_L]  (hidden comment: GRM188R61A106ME69D)
C78  value 10µF  Case/Package: 0603  Voltage Rating: 10V  [CAPC0603(1608)100_L]  (hidden comment: GRM188R61A106ME69D)
C81  value 150µF  Voltage Rating: 10V  [RESTL1210(3225)_L]  (hidden comment: TLJB157M010R0500)
C82  value 150µF  Voltage Rating: 10V  [RESTL1210(3225)_L]  (hidden comment: TLJB157M010R0500)
C83  value 22µF  Voltage Rating: 10V  Case/Package: 0603  [CAPC0603(1608)100_N]  (hidden comment: GRM188R61A226ME15D)
D7  BELAGO1.1  [Belago1.1]  (value not drawn)
D8  SFH 4725AS  [SFH 4715AS]  (value not drawn)
L4  Current Rating: 3A  Case/Package: 0805  [SMD-0805]  (hidden comment: 742792011)
R77  value 300k  Case/Package: 0402  [RESC0402(1005)_N]  (hidden comment: RC0402FR-07300KL)
R78  value 10k  Case/Package: 0402  [RESC0402(1005)_N]  (hidden comment: RC0402FR-1310KL)
R79  value 360k  Case/Package: 0402  [RESC0402(1005)_N]  (hidden comment: RC0402FR-07360KL)
R128  value 0  Case/Package: 0402  [RESC0402(1005)_L]  (hidden comment: CRCW04020000Z0ED)
TP4  TEST_POINT  [TP075_150_NS]  (value not drawn)  (no BOM)
TP6  TEST_POINT  [TP075_150_NS]  (value not drawn)  (no BOM)
TP7  TEST_POINT  [TP075_150_NS]  (value not drawn)  (no BOM)
U11  LM3644YFFR  [LM3644YFFR]

### Ports
GND, I2C2 (harness I2C2), STRB (in), VDD_5V

### Harnesses
I2C2: I2C2_SDA, I2C2_SCL

### Nets
5V_LED: C77.2 C81.1 C82.1 C83.2 L4.2 R77.2 TP4.1 U11.A2(IN) U11.B1(SW)
GND: C77.1 C78.2 C81.2 C82.2 C83.1 D7.4(Cathode) D8.2(Cathode) R78.1 R79.1 U11.A1(GND) ; port GND
VDD_5V: L4.1 ; port VDD_5V
HWEN: D7.3(Sense_2) R79.2 U11.C2(HWEN) U11.D2(TX)
I2C2_SCL: U11.B3(SCL) ; port I2C2.I2C2_SCL
I2C2_SDA: U11.A3(SDA) ; port I2C2.I2C2_SDA
LED1: D8.1(Anode) TP6.1 U11.D3(LED1)
LED2: D7.2(Anode) TP7.1 U11.D1(LED2)
STRB: R78.2 R128.2 ; port STRB
STRB_IR_DRV: R128.1 U11.B2(STROBE) U11.C3(TORCH/TEMP)
NetC78_1: C78.1 U11.C1(OUT)
NetD7_1: D7.1(Sense1) R77.1

### Layout directives
net class PWR; Current Rating: 2A: LED1, LED2

### Notes on the sheet
- Only applicable if TORCH/TEMPT-STROBE and HWEN-TX are connected together to avoid using uVias:
  To ensure that the LM3643/4/8 does not create a false TX or TORCH/TEMP event, the pin-enable bits for these functions must be disabled via I2C. Bit 7 and Bit 4 in register 0x01 must be set to logic 0 to disable the pin functionality.
- Why the inductor is not necessary on our application?
- Imax: 1.5A/ channel
- How to determine the pull up and down resistor on the interlock? Please note that there are internal 300k pull down resistors on HWEN and TX of LM3644 separately.
- If anode and cathode connections are long they should be on separate layers and one routed above/below the other.
  GND should be connected together at LM3644 GND pin point.
  Cathode coppper plane must be big enough to dissipate heat from projector.
- The resistive interlock is equivalent to a simple resistance as shown on the symbol.
  Treshold set on 2.475V
- (near U11) I2C address: 0x63
- Title
- Size:
- Date:
- Tabloid
- Number:
- Time:
- Revision:
- Sheet
- of
- Drawn by:

### Library data of the parts
C77 C78 = CMP-004-000018-4: CAP CER 10UF 10V X5R 0603 20%; Manufacturer 1: Murata; Manufacturer Part Number 1: GRM188R61A106ME69D; Min Operating Temperature: -55°C; Max Operating Temperature: 85°C; Tolerance: 20%; Dielectric: X5R; Length: 1.6mm; Height: 0.8mm; Width: 0.8mm; Depth: 0.8mm; ComponentLink1URL: http://www.mouser.com/ds/2/281/c02e-2905.pdf?src-supplier=Mouser; ComponentLink1Description: http://www.mouser.com/ds/2/281/c02e-2905.pdf?src-supplier=Mouser; ComponentLink2URL: http://components.arrow.com/part/dataview/0323_06119472?src-supplier=Arrow+Europe; ComponentLink2Description: http://components.arrow.com/part/dataview/0323_06119472?src-supplier=Arrow+Europe; ComponentLink3URL: http://www.farnell.com/datasheets/2048014.pdf?src-supplier=Farnell; ComponentLink3Description: http://www.farnell.com/datasheets/2048014.pdf?src-supplier=Farnell; ComponentLink4URL: http://www.farnell.com/datasheets/1872210.pdf?src-supplier=Farnell; ComponentLink4Description: http://www.farnell.com/datasheets/1872210.pdf?src-supplier=Farnell; ComponentLink5URL: http://search.murata.co.jp/Ceramy/image/img/A01X/G101/ENG/GRM188R61A106ME69-01.pdf?src-supplier=Digi-Key; ComponentLink5Description: http://search.murata.co.jp/Ceramy/image/img/A01X/G101/ENG/GRM188R61A106ME69-01.pdf?src-supplier=Digi-Key; ComponentLink6URL: http://www.farnell.com/datasheets/1872210.pdf?src-supplier=Newark; ComponentLink6Description: http://www.farnell.com/datasheets/1872210.pdf?src-supplier=Newark; ComponentLink7URL: http://www.farnell.com/datasheets/2048014.pdf?src-supplier=Element14; ComponentLink7Description: http://www.farnell.com/datasheets/2048014.pdf?src-supplier=Element14; ComponentLink8URL: http://www.farnell.com/datasheets/2048014.pdf?src-supplier=Newark; ComponentLink8Description: http://www.farnell.com/datasheets/2048014.pdf?src-supplier=Newark; Design Item ID: GRM188R61A106ME69D; Mounting Technology: SMT
C81 C82 = CMP-050-000000-4: CAP TAL 150UF 10V 20%; Manufacturer 1: Kyocera AVX; Polarity: Polarized; Capacitor Type: Tantalum; ComponentLink10URL: https://datasheet.ciiva.com/7773/1533257-7773834.pdf?src-supplier=Element14; ComponentLink1Description: https://datasheet.ciiva.com:443/pdfs/VipMasterIC/IC/AVXC/AVXC-S-A0008508048/AVXC-S-A0008508048-1.pdf?src-supplier=IHS+Markit; ComponentLink12Description: https://datasheet.ciiva.com/17339/tlj-17339422.pdf?src-supplier=Avnet+Europe; Min Operating Temperature: -55°C; ComponentLink12URL: https://datasheet.ciiva.com/17339/tlj-17339422.pdf?src-supplier=Avnet+Europe; ComponentLink1URL: https://datasheet.ciiva.com:443/pdfs/VipMasterIC/IC/AVXC/AVXC-S-A0008508048/AVXC-S-A0008508048-1.pdf?src-supplier=IHS+Markit; ComponentLink3URL: https://datasheet.ciiva.com/264/tlj-264787.pdf?src-supplier=Digi-Key; ComponentLink9URL: https://datasheet.ciiva.com/14606/70001364-14606409.pdf?src-supplier=Allied+Electronics; ComponentLink7URL: https://datasheet.ciiva.com/7773/1533257-7773833.pdf?src-supplier=Element14; ComponentLink4URL: https://datasheet.ciiva.com/264/tlj-264788.pdf?src-supplier=Digi-Key; Design Item ID: TLJB157M010R0500; ComponentLink8Description: https://datasheet.ciiva.com/14593/70001364-14593673.pdf?src-supplier=Allied+Electronics; ComponentLink6Description: https://datasheet.ciiva.com/28515/tlj-28515528.pdf?src-supplier=Element14; ComponentLink4Description: https://datasheet.ciiva.com/264/tlj-264788.pdf?src-supplier=Digi-Key; ComponentLink2Description: https://datasheet.ciiva.com/264/tlj-264786.pdf?src-supplier=Digi-Key; Manufacturer Part Number 1: TLJB157M010R0500; ComponentLink11URL: https://datasheet.ciiva.com/11229/tlj-11229389.pdf?src-supplier=Avnet; ComponentLink9Description: https://datasheet.ciiva.com/14606/70001364-14606409.pdf?src-supplier=Allied+Electronics; Max Operating Temperature: 125°C; ComponentLink5URL: https://datasheet.ciiva.com/46385/1910903-46385237.pdf?src-supplier=Element14; Width: 2.8mm; ComponentLink7Description: https://datasheet.ciiva.com/7773/1533257-7773833.pdf?src-supplier=Element14; ComponentLink8URL: https://datasheet.ciiva.com/14593/70001364-14593673.pdf?src-supplier=Allied+Electronics; ComponentLink6URL: https://datasheet.ciiva.com/28515/tlj-28515528.pdf?src-supplier=Element14; Length: 3.5mm; Height: 1.9mm; ComponentLink5Description: https://datasheet.ciiva.com/46385/1910903-46385237.pdf?src-supplier=Element14; ComponentLink2URL: https://datasheet.ciiva.com/264/tlj-264786.pdf?src-supplier=Digi-Key; ComponentLink11Description: https://datasheet.ciiva.com/11229/tlj-11229389.pdf?src-supplier=Avnet; ComponentLink10Description: https://datasheet.ciiva.com/7773/1533257-7773834.pdf?src-supplier=Element14; ComponentLink3Description: https://datasheet.ciiva.com/264/tlj-264787.pdf?src-supplier=Digi-Key; Tolerance: 20%; Mounting Technology: SMT; Case/Package: 1411
C83 = CMP-108-000020-4: CAP CER 22UF 10V X5R 0603 20%; Manufacturer 1: Murata; Tolerance: 20%; Max Operating Temperature: 85°C; ComponentLink1Description: https://datasheet.ciiva.com/46444/1769893-46444975.pdf?src-supplier=Element14; Min Operating Temperature: -55°C; Manufacturer Part Number 1: GRM188R61A226ME15D; Mounting Technology: SMT; Depth: 0.8mm; Design Item ID: GRM188R61A226ME15D; Height: 0.8mm; Dielectric: X5R; Width: 0.8mm; Length: 1.6mm; ComponentLink1URL: https://datasheet.ciiva.com/46444/1769893-46444975.pdf?src-supplier=Element14
D7 = CMP-004-00032-3: Dot-Pattern Infrared Illuminator for 3D Stereoscopic / Imaging AQAA-20; Manufacturer Part Number 1: Belago1.1 AQAA-20
D8 = CMP-004-00043-2: OSLON Black Series (940 nm) - 80°; Manufacturer Part Number 1: SFH 4725AS A01
L4 = CMP-006-00026-2: Ferrite Chip, 1 Function(s), 3A, 2 Pin(s); Manufacturer 1: Wurth electronic; Manufacturer Part Number 1: 742792011
R77 = CMP-013-000049-8: RES SMD 300K OHM 1% 1/16W 0402; Manufacturer 1: Yageo; Voltage Rating: 50V; Power Rating: 63mW; Tolerance: 1%; Design Item ID: RC0402FR-07300KL; Max Operating Temperature: 155°C; Manufacturer Part Number 1: RC0402FR-07300KL; Min Operating Temperature: -55°C
R78 = CMP-115-000004-8: as R93-R95 on sheet TOF_VGA; Min Operating Temperature: -55°C; Max Operating Temperature: 155°C; Design Item ID: RC0402FR-1310KL; Tolerance: 1%; Manufacturer Part Number 1: RC0402FR-1310KL
R79 = CMP-013-000051-9: RES SMD 360K OHM 1% 1/16W 0402; Manufacturer 1: Yageo; Power Rating: 62.5mW; Min Operating Temperature: -55°C; Design Item ID: RC0402FR-07360KL; Max Operating Temperature: 155°C; Tolerance: 1%; Manufacturer Part Number 1: RC0402FR-07360KL
R128 = CMP-013-000022-11: as R59 on sheet LEFT_CCM; Max Operating Temperature: 155°C; Manufacturer Part Number 1: CRCW04020000Z0ED; Tolerance: 5%; Min Operating Temperature: -55°C; Design Item ID: CRCW04020000Z0ED
TP4 TP6 TP7 = CMP-015-000000-2: Manufacturer Part Number 1: /; Source: LuxonisMaster.SchLib; Design Item ID: TEST_POINT
U11 = CMP-006-000006-2: LED Driver, 2-Segment, PBGA12; Manufacturer 1: Texas Instruments; Multiplexed Display Capability: No; Data Input Mode: SERIAL; Package Body Material: Plastic; Min Supply Voltage: 2.5V; Number of Segments: 2; Supply Voltage-Nom: 3.6V; Number of Functions: 1; Max Supply Voltage: 5.5V; Interface IC Type: LED DISPLAY DRIVER; Category: LED Drivers; ComponentLink2URL: https://datasheet.ciiva.com/48475/lm3644-48475318.pdf?src-supplier=Avnet; Pricing 1: 1=0,64580, 10=0,63600, 25=0,62590, 100=0,61590, 250=0,60610, 500=0,59600, 1000=0,58600, 3000=0,35000, 30000=0,34520, 300000=0,31610, 1500000=0,29870, 3000000=0,29850 (USD); Peak Reflow Temperature (Cel): 260°C; Package Shape: Rectangular; Temperature Grade: INDUSTRIAL; Source: DM9098.SchLib; Moisture Sensitivity Level: 1; Stock 1: 2033; Surface Mount: Yes; RoHS Compliant: Yes; Package Style: GRID ARRAY, VERY THIN PROFILE, FINE PITCHMeter; Terminal Finish: Copper; REACH SVHC: Yes; JESD-609 Code: e1; Terminal Position: BOTTOM; Length: 1.66mm; Height - Seated (Max): 0.625mm; RoHS: Yes; Number of Pins: 12; Manufacturer Part Number 1: LM3644YFFR; Package Code: VFBGA; ComponentLink1URL: https://www.ti.com:443/lit/ds/symlink/lm3644.pdf?src-supplier=IHS+Markit; Width: 1.28mm; Min Operating Temperature: -40°C; ComponentLink1Description: https://www.ti.com:443/lit/ds/symlink/lm3644.pdf?src-supplier=IHS+Markit; Terminal Pitch: 0.4mm; ComponentLink2Description: https://datasheet.ciiva.com/48475/lm3644-48475318.pdf?src-supplier=Avnet; Terminal Form: Ball; Max Operating Temperature: 85°C; Design Item ID: LM3644

## Sheet BTB_CONN.SchDoc: =project_title
size Tabloid; CompanyName: Luxonis Holding; DrawnBy: Eason Lin; Organization: Luxonis Holding; Address1: 1925 Harmony Park Drive; Address2: Westminster, CO; Address3: 80234; Address4: United States; DocumentNumber: D2088000; Revision: R0M0E0; SheetNumber: 3; SheetTotal: 14
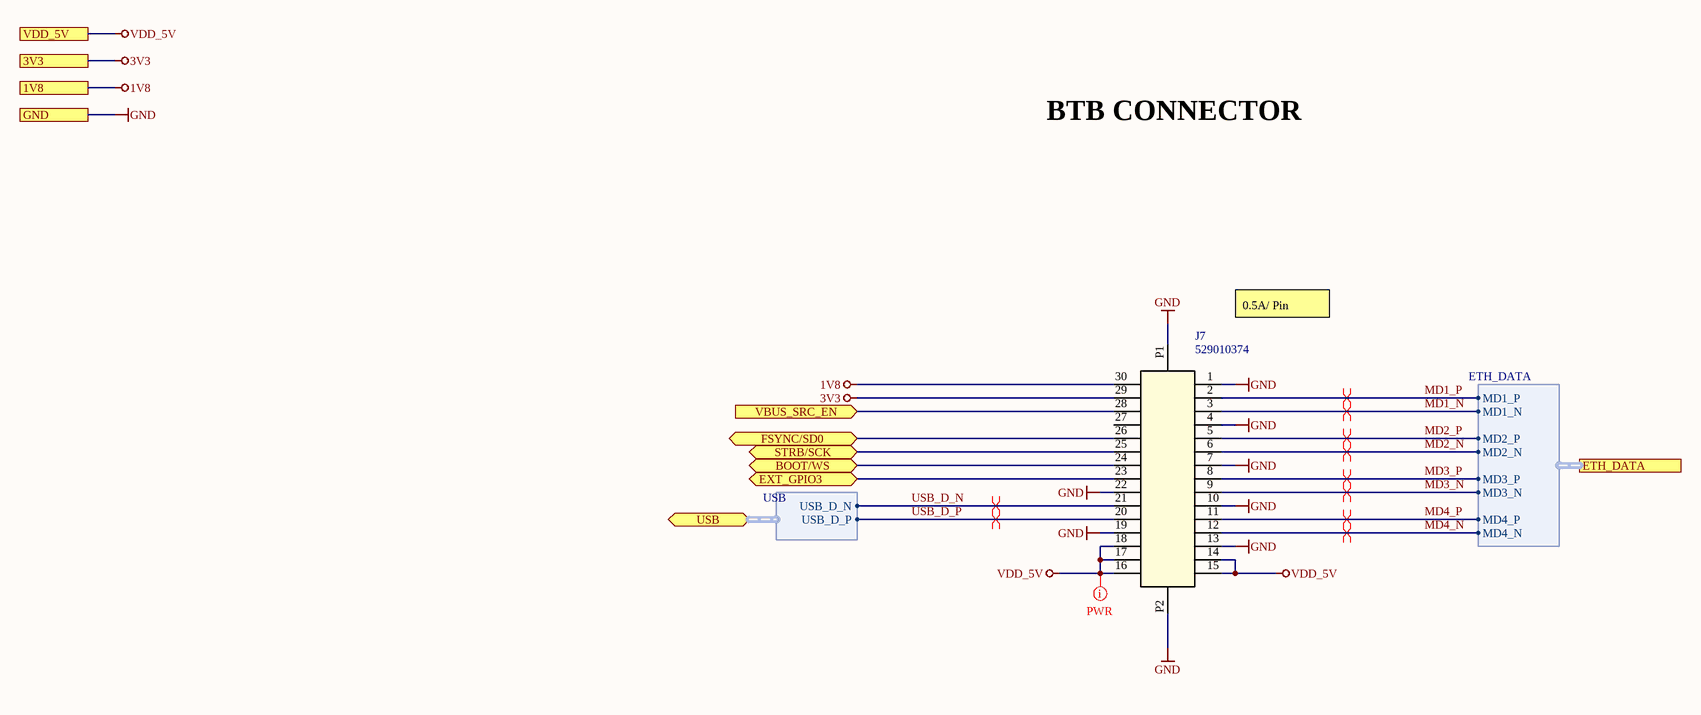
[diagram p13: BTB_CONN.SchDoc]

### Parts
J7  529010374  [CON_529010374]

### Ports
1V8, 3V3, BOOT/WS (bidir), ETH_DATA (harness ETH_DATA), EXT_GPIO3 (bidir), FSYNC/SD0 (bidir), GND, STRB/SCK (bidir), USB (bidir, harness USB), VBUS_SRC_EN (in), VDD_5V

### Harnesses
ETH_DATA: MD1_P, MD1_N, MD2_P, MD2_N, MD3_P, MD3_N, MD4_P, MD4_N
USB: USB_D_P, USB_D_N

### Nets
1V8: J7.30 ; port 1V8
3V3: J7.29 ; port 3V3
GND: J7.1 J7.4 J7.7 J7.10 J7.13 J7.19 J7.22 J7.P1 J7.P2 ; port GND
VDD_5V: J7.14 J7.15 J7.16 J7.17 J7.18 ; port VDD_5V
BOOT/WS: J7.24 ; port BOOT/WS
FSYNC/SD0: J7.26 ; port FSYNC/SD0
IO50/I2S2_IN_SD0: J7.23 ; port EXT_GPIO3
MD1_N: J7.3 ; port ETH_DATA.MD1_N
MD1_P: J7.2 ; port ETH_DATA.MD1_P
MD2_N: J7.6 ; port ETH_DATA.MD2_N
MD2_P: J7.5 ; port ETH_DATA.MD2_P
MD3_N: J7.9 ; port ETH_DATA.MD3_N
MD3_P: J7.8 ; port ETH_DATA.MD3_P
MD4_N: J7.12 ; port ETH_DATA.MD4_N
MD4_P: J7.11 ; port ETH_DATA.MD4_P
STRB/SCK: J7.25 ; port STRB/SCK
USB_D_N: J7.21 ; port USB.USB_D_N
USB_D_P: J7.20 ; port USB.USB_D_P
NetJ7_28: J7.28 ; port VBUS_SRC_EN

Not connected (* = marked no-connect by the designer): J7 27

### Layout directives
differential pair; net class USB2; differential pair class 85ohm: USB_D_N, USB_D_P
differential pair; net class ETH; differential pair class 100ohm: MD1_N, MD1_P, MD2_N, MD2_P, MD3_N, MD3_P, MD4_N, MD4_P
net class PWR; Current Rating: 3A: VDD_5V

### Notes on the sheet
- BTB CONNECTOR
- 0.5A/ Pin
- Title
- Size:
- Date:
- Tabloid
- Number:
- Time:
- Revision:
- Sheet
- of
- Drawn by:

### Library data of the parts
J7 = CMP-002-00150-3: CONN, Board-to-Board Connector, Mezzanine, 0.635mm pitch, 2x15, 30 positions, Receptacle, Mated height 12 to 16mm; Manufacturer 1: Molex; Connector Type: BOARD STACKING CONNECTOR; Max Current Rating: 500mA; Voltage Rating: 100V; Manufacturer Part Number 1: 529010374; Pins: 2x15; Min Operating Temperature: -55°C; Max Operating Temperature: 105°C; Mounting Technology: Board; System: Connector

## Nets that join several sheets
1V2: POWER_GEN (R69.2 TP14.1), RIGHT_CCM (FB5.1), LEFT_CCM (FB3.1)
1V8: CONNECTOR_B (15 pins), ETH_PCIE_CTRL (C19.2 R44.1 U3.3), BOOT_JTAG_AUX (J1.7 TP24.1), POWER_GEN (R64.2 TP18.1), TOF_VGA (J9.1 R93.1 R94.1), RIGHT_CCM (FB1.1), LEFT_CCM (FB2.1), IMU (9 pins), EEPROM (5 pins), BTB_CONN (J7.30)
2V8: POWER_GEN (R65.2 TP19.1), RIGHT_CCM (R129.1), LEFT_CCM (R58.1)
3V3: ETH_PCIE_CTRL (18 pins), BOOT_JTAG_AUX (C1.1 J1.9 J2.4), POWER_GEN (5 pins), TOF_VGA (FB4.1), IMU (5 pins), BTB_CONN (J7.29)
3V3_VCSEL: POWER_GEN (R76.2 TP35.1), TOF_VGA (12 pins)
GND: TopLevel (MTG1.1 MTG2.1), CONNECTOR_B (45 pins), CONNECTOR_A (35 pins), ETH_PCIE_CTRL (26 pins), BOOT_JTAG_AUX (17 pins), POWER_GEN (29 pins), TOF_VGA (24 pins), RIGHT_CCM (19 pins), LEFT_CCM (19 pins), IMU (14 pins), EEPROM (6 pins), DOT_LED (10 pins), BTB_CONN (9 pins)
VDD_5V: CONNECTOR_B (9 pins), BOOT_JTAG_AUX (D3.1 R3.2 R4.2), POWER_GEN (16 pins), DOT_LED (L4.1), BTB_CONN (5 pins)
2485_PGOOD: CONNECTOR_A (J4.37), BOOT_JTAG_AUX (J3.5 Q1.1)
2485_WAKEUP: CONNECTOR_A (J4.41 R9.1), BOOT_JTAG_AUX (J3.7)
BMI270_INT_1V8: CONNECTOR_B (J5.66), IMU (U5.4)
BMI270_WAKE_1V8: CONNECTOR_B (J5.72), IMU (U5.9)
BNO08x_BOOTN_1V8: CONNECTOR_B (J5.54), IMU (R48.2)
BNO08x_INT_1V8: CONNECTOR_B (J5.62), IMU (TP12.1 U4.14)
BNO08x_RSTn_1V8: CONNECTOR_B (J5.44), IMU (TP11.1 U4.11)
BNO08x_WAKE_1V8: CONNECTOR_B (J5.60), IMU (U4.6)
BOOT0/LED_B: CONNECTOR_B (J5.26 R12.1 R21.2), BOOT_JTAG_AUX (Q5.1)
BOOT2/LED_R: CONNECTOR_B (J5.22 R14.1 R18.1 R23.2), BOOT_JTAG_AUX (Q2.1)
BOOT7/LED_G: CONNECTOR_B (J5.28 R11.1 R19.1 R20.2), BOOT_JTAG_AUX (Q4.1)
BOOT/WS: CONNECTOR_B (U13.4), BTB_CONN (J7.24)
BOOT/WS_SEL: CONNECTOR_B (R74.2 U13.6), CONNECTOR_A (J4.66)
CAM_A_CLK_OUT: CONNECTOR_A (J4.28), TOF_VGA (J9.3)
CAM_A_PWDN_N: CONNECTOR_A (J4.34), TOF_VGA (J9.9 R93.2)
CAM_B_CLK_OUT: CONNECTOR_A (J4.73), RIGHT_CCM (J10.3), LEFT_CCM (J6.3)
CAM_B_PWDN_N: CONNECTOR_A (J4.67), LEFT_CCM (J6.9 R61.2)
CAM_R_PWM: CONNECTOR_B (J5.74), RIGHT_CCM (J10.9 R55.2)
EXT_FSYNC_1V8: CONNECTOR_B (U6.1), CONNECTOR_A (R107.2)
FSYNC/SD0: CONNECTOR_B (U6.4), BTB_CONN (J7.26)
GPIO7/sd_hst_cd: CONNECTOR_A (J4.59), BOOT_JTAG_AUX (R1.1)
I2C0_SCL: CONNECTOR_B (J5.34), EEPROM (U1.6)
I2C0_SDA: CONNECTOR_B (J5.36), EEPROM (U1.5)
I2C1_SCL: CONNECTOR_A (J4.35), TOF_VGA (J9.7)
I2C1_SDA: CONNECTOR_A (J4.33), TOF_VGA (J9.5)
I2C2_SCL: CONNECTOR_A (J4.77), LEFT_CCM (J6.7), DOT_LED (U11.B3)
I2C2_SDA: CONNECTOR_A (J4.79), LEFT_CCM (J6.5), DOT_LED (U11.A3)
I2C3_SCL: CONNECTOR_A (J4.78), BOOT_JTAG_AUX (J3.2), RIGHT_CCM (J10.7)
I2C3_SDA: CONNECTOR_A (J4.80), BOOT_JTAG_AUX (J3.4), RIGHT_CCM (J10.5)
I2C4_SCL_1V8: CONNECTOR_B (J5.59), BOOT_JTAG_AUX (TP36.1)
I2C4_SDA_1V8: CONNECTOR_B (J5.57), BOOT_JTAG_AUX (TP25.1)
IO50/I2S2_IN_SD0: CONNECTOR_B (J5.21), BTB_CONN (J7.23)
MD1_N: ETH_PCIE_CTRL (U2.2), BTB_CONN (J7.3)
MD1_P: ETH_PCIE_CTRL (U2.1), BTB_CONN (J7.2)
MD2_N: ETH_PCIE_CTRL (U2.5), BTB_CONN (J7.6)
MD2_P: ETH_PCIE_CTRL (U2.4), BTB_CONN (J7.5)
MD3_N: ETH_PCIE_CTRL (U2.7), BTB_CONN (J7.9)
MD3_P: ETH_PCIE_CTRL (U2.6), BTB_CONN (J7.8)
MD4_N: ETH_PCIE_CTRL (U2.10), BTB_CONN (J7.12)
MD4_P: ETH_PCIE_CTRL (U2.9), BTB_CONN (J7.11)
MIPI_RX2_C_N: CONNECTOR_A (J4.95), LEFT_CCM (J6.20)
MIPI_RX2_C_P: CONNECTOR_A (J4.97), LEFT_CCM (J6.19)
MIPI_RX2_D0_N: CONNECTOR_A (J4.89), LEFT_CCM (J6.26)
MIPI_RX2_D0_P: CONNECTOR_A (J4.91), LEFT_CCM (J6.25)
MIPI_RX2_D1_N: CONNECTOR_A (J4.83), LEFT_CCM (J6.22)
MIPI_RX2_D1_P: CONNECTOR_A (J4.85), LEFT_CCM (J6.23)
MIPI_RX3_C_N: CONNECTOR_A (J4.96), RIGHT_CCM (J10.20)
MIPI_RX3_C_P: CONNECTOR_A (J4.98), RIGHT_CCM (J10.19)
MIPI_RX3_D0_N: CONNECTOR_A (J4.90), RIGHT_CCM (J10.26)
MIPI_RX3_D0_P: CONNECTOR_A (J4.92), RIGHT_CCM (J10.25)
MIPI_RX3_D1_N: CONNECTOR_A (J4.84), RIGHT_CCM (J10.22)
MIPI_RX3_D1_P: CONNECTOR_A (J4.86), RIGHT_CCM (J10.23)
MIPI_RX4_C_N: CONNECTOR_A (J4.3), TOF_VGA (J9.20)
MIPI_RX4_C_P: CONNECTOR_A (J4.5), TOF_VGA (J9.19)
MIPI_RX4_D0_N: CONNECTOR_A (J4.9), TOF_VGA (J9.26)
MIPI_RX4_D0_P: CONNECTOR_A (J4.11), TOF_VGA (J9.25)
MIPI_RX4_D1_N: CONNECTOR_A (J4.15), TOF_VGA (J9.22)
MIPI_RX4_D1_P: CONNECTOR_A (J4.17), TOF_VGA (J9.23)
MODULE_nRST: CONNECTOR_A (J4.39 SW1.1 SW1.3 TP1.1), BOOT_JTAG_AUX (J3.1)
NetJ7_28: CONNECTOR_B (R114.1), BTB_CONN (J7.28)
PCIe_CLKREQ_N_1V8: CONNECTOR_B (J5.65), ETH_PCIE_CTRL (U3.4)
PCIe_ISOLATE_N_1V8: CONNECTOR_B (R28.2), ETH_PCIE_CTRL (U3.5)
PCIe_PERST_1V8: CONNECTOR_B (J5.68), ETH_PCIE_CTRL (Q6.1)
sd_hst0_clk: CONNECTOR_A (J4.61), BOOT_JTAG_AUX (J2.5)
sd_hst0_cmd: CONNECTOR_A (J4.63), BOOT_JTAG_AUX (J2.3)
sd_hst0_dat_0: CONNECTOR_A (J4.40), BOOT_JTAG_AUX (J2.7)
sd_hst0_dat_1: CONNECTOR_A (J4.38), BOOT_JTAG_AUX (J2.8)
sd_hst0_dat_2: CONNECTOR_A (J4.36), BOOT_JTAG_AUX (J2.1)
sd_hst0_dat_3: CONNECTOR_A (J4.32), BOOT_JTAG_AUX (J2.2)
SDS_CLK_N: CONNECTOR_B (J5.81), ETH_PCIE_CTRL (R37.1)
SDS_CLK_P: CONNECTOR_B (J5.83), ETH_PCIE_CTRL (R36.1)
SDS_RXD_N: CONNECTOR_B (J5.77), ETH_PCIE_CTRL (C18.2)
SDS_RXD_P: CONNECTOR_B (J5.75), ETH_PCIE_CTRL (C17.2)
SDS_TXD_N: CONNECTOR_B (J5.71), ETH_PCIE_CTRL (U2.14)
SDS_TXD_P: CONNECTOR_B (J5.69), ETH_PCIE_CTRL (U2.13)
SOM_FSYNC: CONNECTOR_B (R26.2 U6.3), CONNECTOR_A (R10.2), BOOT_JTAG_AUX (J3.8), TOF_VGA (R96.2), RIGHT_CCM (R123.2), LEFT_CCM (R62.2)
SPI_BMI270_CS_1V8: CONNECTOR_A (J4.60), IMU (U5.12)
SPI_BNO085_CS_1V8: CONNECTOR_A (J4.70), IMU (U4.18)
SPI_MISO_1V8: CONNECTOR_A (J4.64), IMU (U4.20 U5.1)
SPI_MOSI_1V8: CONNECTOR_A (J4.62), IMU (U4.17 U5.14)
SPI_SCK_1V8: CONNECTOR_A (J4.74), IMU (U4.19 U5.13)
STRB: CONNECTOR_B (U12.3), BOOT_JTAG_AUX (J3.6), TOF_VGA (R97.2), RIGHT_CCM (R130.2), LEFT_CCM (R59.2), DOT_LED (R78.2 R128.2)
STRB/SCK: CONNECTOR_B (U12.4), BTB_CONN (J7.25)
SYS_RST: CONNECTOR_B (J5.89), BOOT_JTAG_AUX (J1.6)
TCK: CONNECTOR_B (J5.97), BOOT_JTAG_AUX (J1.2)
TDI: CONNECTOR_B (J5.95), BOOT_JTAG_AUX (J1.3)
TDO: CONNECTOR_B (J5.91), BOOT_JTAG_AUX (J1.5)
TMS: CONNECTOR_B (J5.99), BOOT_JTAG_AUX (J1.1)
TRST: CONNECTOR_B (J5.93), BOOT_JTAG_AUX (J1.4)
USB_D_N: CONNECTOR_B (J5.90), BTB_CONN (J7.21)
USB_D_P: CONNECTOR_B (J5.92), BTB_CONN (J7.20)

## Assembly variants
Production_MX: not fitted B1 J3 R1 R2 R10 R11 R14 R15 R16 R19 R21 R22 R30 R31 R33 R51 R63 R72 R73 R94 R120 SW2
Production_KeemBay: not fitted B1 J3 R1 R2 R11 R16 R17 R18 R21 R22 R23 R24 R26 R30 R31 R33 R51 R63 R72 R73 R94 R120